# Altium project Controller R2.PrjPcb
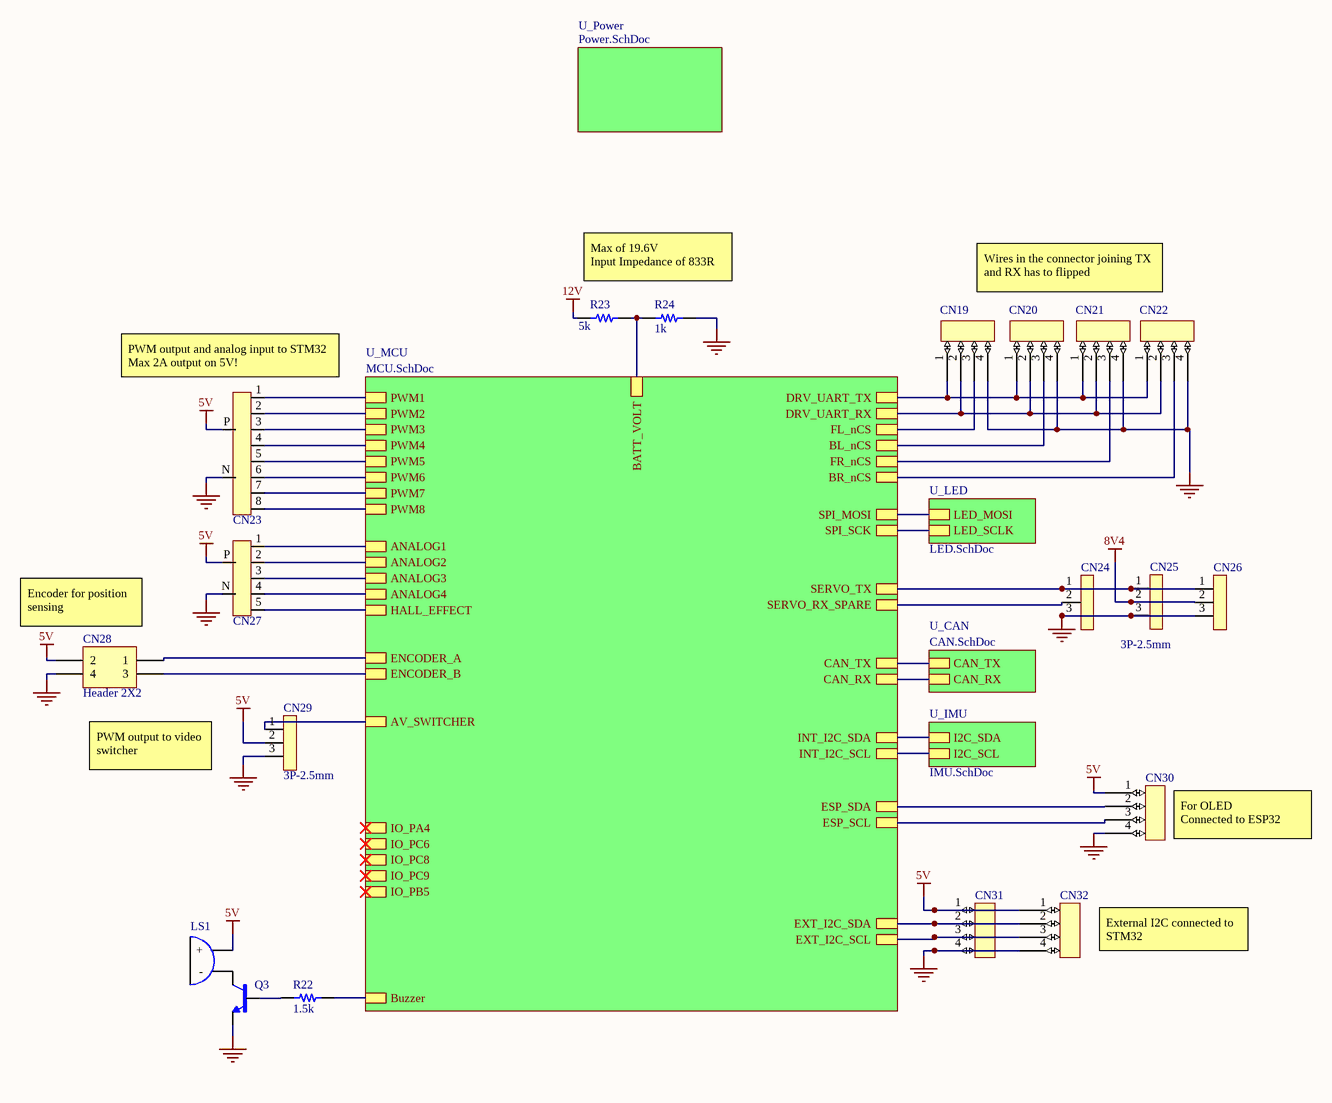
[diagram p0: Controller R2.SchDoc]
6 sheets, 132 parts. Net scope: hierarchical (ports join the sheet entries above them; power ports are global).
Board file: Controller R2.PcbDoc
Sheets:
  Controller R2.SchDoc
    U_Power = Power.SchDoc
    U_CAN = CAN.SchDoc
    U_IMU = IMU.SchDoc
    U_LED = LED.SchDoc
    U_MCU = MCU.SchDoc

## Sheet Controller R2.SchDoc
size A3

### Parts
CN19  JST_GH-4P  [JST_GH-4P]  (value not drawn)
CN20  JST_GH-4P  [JST_GH-4P]  (value not drawn)
CN21  JST_GH-4P  [JST_GH-4P]  (value not drawn)
CN22  JST_GH-4P  [JST_GH-4P]  (value not drawn)
CN23  8P-Signal-2.5mm  [8ch-signal-header]  (value not drawn)
CN24  3P-2.5mm  [2.5mm-3P]  (value not drawn)
CN25  3P-2.5mm  [2.5mm-3P]  (value not drawn)
CN26  3P-2.5mm  [2.5mm-3P]
CN27  5P-Signal-2.5mm  [5ch-signal-header]  (value not drawn)
CN28  Header 2X2  [HDR2X2]
CN29  3P-2.5mm  [2.5mm-3P]
CN30  JST_GH-4P  [JST_GH-4P]  (value not drawn)
CN31  JST_GH-4P  [JST_GH-4P]  (value not drawn)
CN32  JST_GH-4P  [JST_GH-4P]  (value not drawn)
LS1  Buzzer  [12-dia-buzzer]  (value not drawn)
Q3  S8050  [SOT23-FET]  (value not drawn)
R22  1.5k  [0805 - duplicate]
R23  5k  [0805 - duplicate]
R24  1k  [0805 - duplicate]

### Sub-sheets
U_CAN = CAN.SchDoc: CAN_TX, CAN_RX
U_IMU = IMU.SchDoc: I2C_SCL, I2C_SDA
U_LED = LED.SchDoc: LED_MOSI, LED_SCLK
U_MCU = MCU.SchDoc: FL_nCS, BL_nCS, FR_nCS, BR_nCS, PWM5, PWM6, PWM7, PWM8, PWM4, PWM1, ENCODER_A, ENCODER_B, SERVO_TX, SERVO_RX_SPARE, ANALOG1, HALL_EFFECT, ANALOG4, ANALOG3, BATT_VOLT, PWM2, PWM3, SPI_MOSI, SPI_SCK, EXT_I2C_SCL, EXT_I2C_SDA, CAN_TX, CAN_RX, INT_I2C_SDA, INT_I2C_SCL, DRV_UART_RX, DRV_UART_TX, AV_SWITCHER, Buzzer, ESP_SDA, ESP_SCL, IO_PA4, IO_PC6, IO_PC8, IO_PC9, IO_PB5, ANALOG2
U_Power = Power.SchDoc: no entries

### Nets
5V: CN23.P CN27.P CN28.2 CN29.2 CN30.1 CN31.1 CN32.1 LS1.A(+)
8V4: CN25.2 CN26.2
12V: R23.1
GND: CN19.4 CN20.4 CN21.4 CN22.4 CN23.N CN24.3 CN25.3 CN26.3 CN27.N CN28.4 CN29.3 CN30.4 CN31.4 CN32.4 Q3.2(E) R24.2
SWO: CN19.1 CN20.1 CN21.1 CN22.1 ; sheet U_MCU/DRV_UART_TX
NetCN19_2: CN19.2 CN20.2 CN21.2 CN22.2 ; sheet U_MCU/DRV_UART_RX
NetCN19_3: CN19.3 ; sheet U_MCU/FL_nCS
NetCN20_3: CN20.3 ; sheet U_MCU/BL_nCS
NetCN21_3: CN21.3 ; sheet U_MCU/FR_nCS
NetCN22_3: CN22.3 ; sheet U_MCU/BR_nCS
NetCN23_1: CN23.1 ; sheet U_MCU/PWM1
NetCN23_2: CN23.2 ; sheet U_MCU/PWM2
NetCN23_3: CN23.3 ; sheet U_MCU/PWM3
NetCN23_4: CN23.4 ; sheet U_MCU/PWM4
NetCN23_5: CN23.5 ; sheet U_MCU/PWM5
NetCN23_6: CN23.6 ; sheet U_MCU/PWM6
NetCN23_7: CN23.7 ; sheet U_MCU/PWM7
NetCN23_8: CN23.8 ; sheet U_MCU/PWM8
NetCN24_1: CN24.1 CN25.1 CN26.1 ; sheet U_MCU/SERVO_TX
NetCN24_2: CN24.2 ; sheet U_MCU/SERVO_RX_SPARE
NetCN27_1: CN27.1 ; sheet U_MCU/ANALOG1
NetCN27_2: CN27.2 ; sheet U_MCU/ANALOG2
NetCN27_3: CN27.3 ; sheet U_MCU/ANALOG3
NetCN27_4: CN27.4 ; sheet U_MCU/ANALOG4
NetCN27_5: CN27.5 ; sheet U_MCU/HALL_EFFECT
NetCN28_1: CN28.1 ; sheet U_MCU/ENCODER_A
NetCN28_3: CN28.3 ; sheet U_MCU/ENCODER_B
NetCN29_1: CN29.1 ; sheet U_MCU/AV_SWITCHER
NetCN30_2: CN30.2 ; sheet U_MCU/ESP_SDA
NetCN30_3: CN30.3 ; sheet U_MCU/ESP_SCL
NetCN31_2: CN31.2 CN32.2 ; sheet U_MCU/EXT_I2C_SDA
NetCN31_3: CN31.3 CN32.3 ; sheet U_MCU/EXT_I2C_SCL
NetLS1_K: LS1.K(-) Q3.3(C)
NetQ3_1: Q3.1(B) R22.1
NetR22_2: R22.2 ; sheet U_MCU/Buzzer
NetR23_2: R23.2 R24.1 ; sheet U_MCU/BATT_VOLT
NetU1_1: sheet U_CAN/CAN_TX, sheet U_MCU/CAN_TX
NetU1_4: sheet U_CAN/CAN_RX, sheet U_MCU/CAN_RX
NetU2_23: sheet U_IMU/I2C_SCL, sheet U_MCU/INT_I2C_SCL
NetU2_24: sheet U_IMU/I2C_SDA, sheet U_MCU/INT_I2C_SDA
NetU3_1: sheet U_LED/LED_MOSI, sheet U_MCU/SPI_MOSI
NetU4_1: sheet U_LED/LED_SCLK, sheet U_MCU/SPI_SCK

### Notes on the sheet
- Max of 19.6V
  Input Impedance of 833R
- Wires in the connector joining TX and RX has to flipped
- (near CN23) PWM output and analog input to STM32
  Max 2A output on 5V!
- (near CN28) Encoder for position sensing
- PWM output to video switcher
- (near CN30) For OLED
  Connected to ESP32
- (near CN32) External I2C connected to STM32

### Library data of the parts
CN28 = Header 2X2: Header, 2-Pin, Dual row; LatestRevisionDate: 17-Jul-2002; LatestRevisionNote: Re-released for DXP Platform.; Publisher: Altium Limited
Q3 = S8050: MF: MICROSS/On Semiconductor; MP: 2N2222; Value: *; Package: TO-18-3 NJS; Digi-Key_Purchase_URL: https://www.digikey.com.mx/product-detail/en/microsemi-corporation/JANS2N2222A/1086-15156-ND/4384334?utm_source=snapeda&utm_medium=aggregator&utm_campaign=symbol; SnapEDA_Link: https://www.snapeda.com/parts/2N2222/MICROSS/On%20Semiconductor/view-part/561967/?ref=snap; Digi-Key_Part_Number: 1086-15156-ND
R22-R24 = Resistor

## Sheet Power.SchDoc
size A3
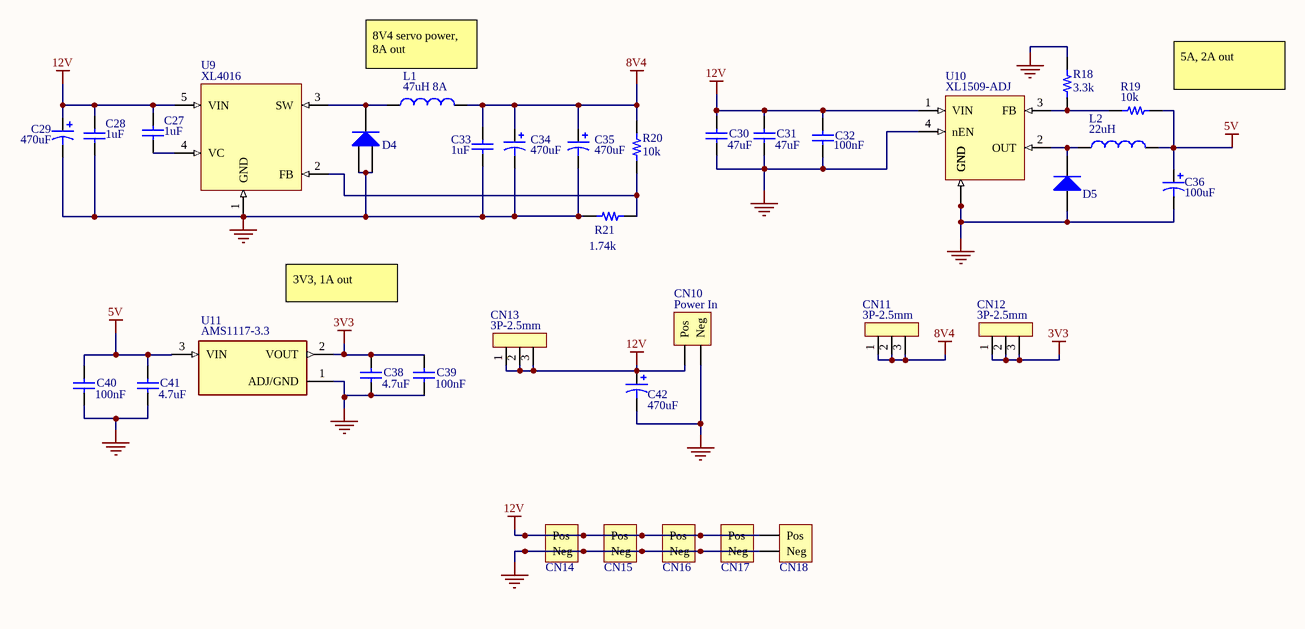
[diagram p1: Power.SchDoc]

### Parts
C27  value 1uF  [0402]  (hidden comment: Cap)
C28  value 1uF  [0402]  (hidden comment: Cap)
C29  470uF  [10x12mm-Electrolytic]
C30  value 47uF  [1206]  (hidden comment: Cap)
C31  value 47uF  [1206]  (hidden comment: Cap)
C32  value 100nF  [0402]  (hidden comment: Cap)
C33  value 1uF  [0402]  (hidden comment: Cap)
C34  470uF  [10x12mm-Electrolytic]
C35  470uF  [10x12mm-Electrolytic]
C36  100uF  [10x12mm-Electrolytic]
C38  value 4.7uF  [0805 - duplicate]  (hidden comment: Cap)
C39  value 100nF  [0402]  (hidden comment: Cap)
C40  value 100nF  [0402]  (hidden comment: Cap)
C41  value 4.7uF  [0805 - duplicate]  (hidden comment: Cap)
C42  470uF  [10x12mm-Electrolytic]
CN10  Power In  [Power_Leads]
CN11  3P-2.5mm  [2.5mm-3P]
CN12  3P-2.5mm  [2.5mm-3P]
CN13  3P-2.5mm  [2.5mm-3P]
CN14  JST_Leads_In  [Power_Leads]  (value not drawn)
CN15  JST_Leads_In  [Power_Leads]  (value not drawn)
CN16  JST_Leads_In  [Power_Leads]  (value not drawn)
CN17  JST_Leads_In  [Power_Leads]  (value not drawn)
CN18  JST_Leads_In  [Power_Leads]  (value not drawn)
D4  Diode  [PowerDi5]  (value not drawn)
D5  SS24  [DO-214AA]  (value not drawn)
L1  47uH 8A  [18x16-9-Inductor]
L2  22uH  [71x66-Inductor]
R18  3.3k  [0805 - duplicate]
R19  10k  [0805 - duplicate]
R20  10k  [0805 - duplicate]
R21  1.74k  [0805 - duplicate]
U9  XL4016  [TO220-5L]
U10  XL1509-ADJ  [SOP8-MT3420]
U11  AMS1117-3.3  [SOT229P700X180-4N]

### Nets
3V3: C38.2 C39.2 CN12.1 CN12.2 CN12.3 U11.2(VOUT)
5V: C36.1 C40.2 C41.2 L2.2 R19.2 U11.3(VIN)
8V4: C33.2 C34.1 C35.1 CN11.1 CN11.2 CN11.3 L1.2 R20.2
12V: C27.2 C28.2 C29.1 C30.2 C31.2 C32.2 C42.1 CN10.A(Pos) CN13.1 CN13.2 CN13.3 CN14.A(Pos) CN15.A(Pos) CN16.A(Pos) CN17.A(Pos) CN18.A(Pos) U9.5(VIN) U10.1(VIN)
GND: C28.1 C29.2 C30.1 C31.1 C32.1 C33.1 C34.2 C35.2 C36.2 C38.1 C39.1 C40.1 C41.1 C42.2 CN10.K(Neg) CN14.K(Neg) CN15.K(Neg) CN16.K(Neg) CN17.K(Neg) CN18.K(Neg) D4.1(A) D4.2(A) D5.A R18.2 R21.1 U9.1(GND) U10.4(nEN) U10.5(GND) U10.6(GND) U10.7(GND) U10.8(GND) U11.1(ADJ/GND)
NetC27_1: C27.1 U9.4(VC)
NetD4_3: D4.3(K) L1.1 U9.3(SW)
NetD5_K: D5.K L2.1 U10.2(OUT)
NetR18_1: R18.1 R19.1 U10.3(FB)
NetR20_1: R20.1 R21.2 U9.2(FB)

### Notes on the sheet
- (near L1) 8V4 servo power, 8A out
- (near R19) 5A, 2A out
- 3V3, 1A out

### Library data of the parts
C29 C34-C36 C42 = Polarised Capacitor
CN10 = JST_Leads_In
D5 = SS24: 2A Schottky Diode
L1 = SMD Inductor 18x16.9: TMPC1707
L2 = 22uH Inductor, 7.1*6.6
R18-R21 = Resistor
U9 = XL4016: 8A Buck COnverter
U10 = XL1509-5
U11 = AMS1117-3.3: Sot223/Pkg 1-Amp 3.3-Volt Low Drop Out Voltage Regulatator; MF: Advanced Monolithic Systems; Price: None; Package: None; Value: *; MP: AMS1117-3.3; Availability: Unavailable; SnapEDA_Link: https://www.snapeda.com/parts/AMS1117-3.3/Advanced%20Monolithic%20Systems/view-part/53450/?ref=snap
C27 C28 C30-C33 C38-C41 = Cap: Published: 8-Jun-2000; LatestRevisionDate: 17-Jul-2002; LatestRevisionNote: Re-released for DXP Platform.; PackageReference: RAD-0.3; Publisher: Altium Limited; PackageDescription: Radial Cap, Thru-Hole; 2 Leads; 0.3 in Pin Spacing
D4 = Diode: Published: 8-Jun-2000; LatestRevisionDate: 17-Jul-2002; LatestRevisionNote: Re-released for DXP Platform.; PackageVersion: Sep-1996; PackageReference: SMC; Publisher: Altium Limited; PackageDescription: DO-214-AB/SMC; 2 C-Bend Leads; Body 7.9 x 5.9 mm, inc. leads (LxW); Code_JEDEC: DO-214-AB

## Sheet CAN.SchDoc
size A3
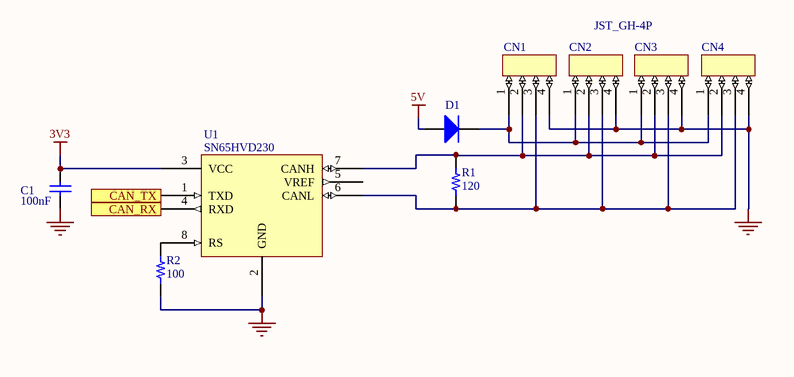
[diagram p2: CAN.SchDoc]

### Parts
C1  value 100nF  [0402]  (hidden comment: Cap)
CN1  JST_GH-4P  [JST_GH-4P]
CN2  JST_GH-4P  [JST_GH-4P]  (value not drawn)
CN3  JST_GH-4P  [JST_GH-4P]  (value not drawn)
CN4  JST_GH-4P  [JST_GH-4P]  (value not drawn)
D1  SS12F  [SMAF_DIODE]  (value not drawn)
R1  120  [2010_SMD_Resistor]
R2  100  [0805 - duplicate]
U1  SN65HVD230  [SOIC8-TI_CAN]

### Ports
CAN_RX, CAN_TX

### Nets
3V3: C1.2 U1.3(VCC)
5V: D1.1(A)
GND: C1.1 CN1.4 CN2.4 CN3.4 CN4.4 R2.1 U1.2(GND)
NetCN1_1: CN1.1 CN2.1 CN3.1 CN4.1 D1.2(K)
NetCN1_2: CN1.2 CN2.2 CN3.2 CN4.2 R1.2 U1.7(CANH)
NetCN1_3: CN1.3 CN2.3 CN3.3 CN4.3 R1.1 U1.6(CANL)
NetR2_2: R2.2 U1.8(RS)
NetU1_1: U1.1(TXD) ; port CAN_TX
NetU1_4: U1.4(RXD) ; port CAN_RX

Not connected (* = marked no-connect by the designer): U1 5(VREF)

### Library data of the parts
R1 R2 = Resistor
U1 = SN65HVD230: CAN Transceiver
C1 = Cap: Published: 8-Jun-2000; LatestRevisionDate: 17-Jul-2002; LatestRevisionNote: Re-released for DXP Platform.; PackageReference: RAD-0.3; Publisher: Altium Limited; PackageDescription: Radial Cap, Thru-Hole; 2 Leads; 0.3 in Pin Spacing

## Sheet IMU.SchDoc
size A3
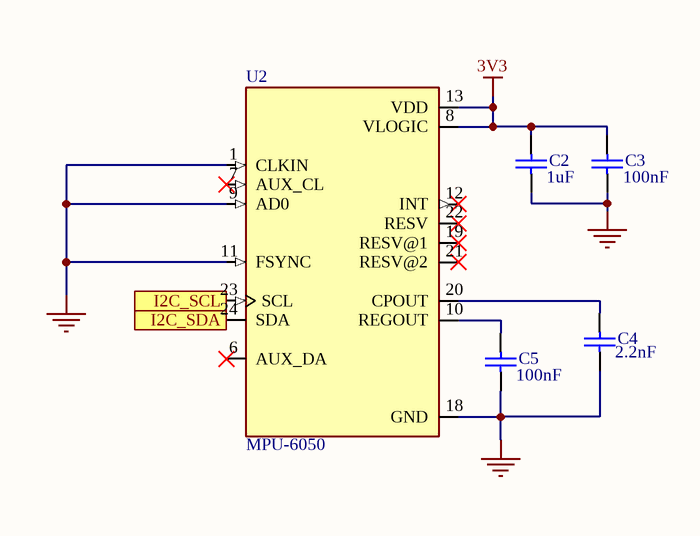
[diagram p3: IMU.SchDoc]

### Parts
C2  value 1uF  [0402]  (hidden comment: Cap)
C3  value 100nF  [0402]  (hidden comment: Cap)
C4  value 2.2nF  [0402]  (hidden comment: Cap)
C5  value 100nF  [0402]  (hidden comment: Cap)
U2  MPU-6050  [QFN50P400X400X95-24N]

### Ports
I2C_SCL, I2C_SDA

### Nets
3V3: C2.2 C3.2 U2.8(VLOGIC) U2.13(VDD)
GND: C2.1 C3.1 C4.1 C5.1 U2.1(CLKIN) U2.9(AD0) U2.11(FSYNC) U2.18(GND)
NetC4_2: C4.2 U2.20(CPOUT)
NetC5_2: C5.2 U2.10(REGOUT)
NetU2_23: U2.23(SCL) ; port I2C_SCL
NetU2_24: U2.24(SDA) ; port I2C_SDA

Not connected (* = marked no-connect by the designer): U2 6(AUX_DA)* 7(AUX_CL)* 12(INT)* 19(RESV@1)* 21(RESV@2)* 22(RESV)*

### Library data of the parts
U2 = MPU-6050: Accelerometer, Gyroscope, 6 Axis Sensor IÂ²C Output; MF: TDK InvenSense; Price: None; Package: VFQFN-24 TDK InvenSense; MP: MPU-6050; Value: *; Availability: Unavailable; SnapEDA_Link: https://www.snapeda.com/parts/MPU-6050/TDK%20InvenSense/view-part/4503180/?ref=snap
C2-C5 = Cap: Published: 8-Jun-2000; LatestRevisionDate: 17-Jul-2002; LatestRevisionNote: Re-released for DXP Platform.; PackageReference: RAD-0.3; Publisher: Altium Limited; PackageDescription: Radial Cap, Thru-Hole; 2 Leads; 0.3 in Pin Spacing

## Sheet LED.SchDoc
size A3
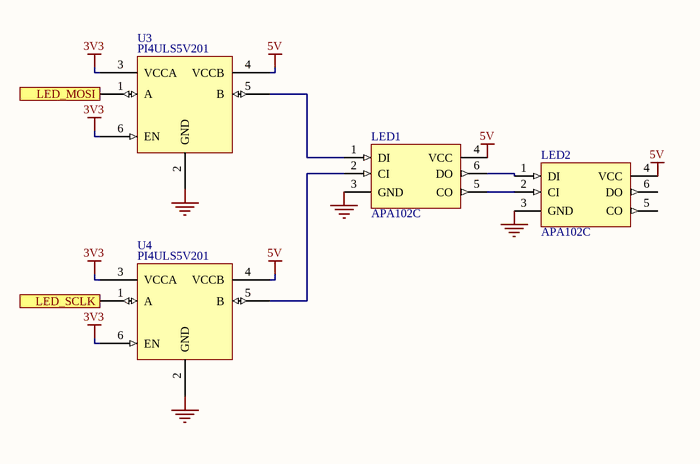
[diagram p4: LED.SchDoc]

### Parts
LED1  APA102C  [5x5_WS2812]
LED2  APA102C  [5x5_WS2812]
U3  PI4ULS5V201  [SOT23-PI4ULS5V201]
U4  PI4ULS5V201  [SOT23-PI4ULS5V201]

### Ports
LED_MOSI, LED_SCLK

### Nets
3V3: U3.3(VCCA) U3.6(EN) U4.3(VCCA) U4.6(EN)
5V: LED1.4(VCC) LED2.4(VCC) U3.4(VCCB) U4.4(VCCB)
GND: LED1.3(GND) LED2.3(GND) U3.2(GND) U4.2(GND)
NetLED1_1: LED1.1(DI) U3.5(B)
NetLED1_2: LED1.2(CI) U4.5(B)
NetLED1_5: LED1.5(CO) LED2.2(CI)
NetLED1_6: LED1.6(DO) LED2.1(DI)
NetU3_1: U3.1(A) ; port LED_MOSI
NetU4_1: U4.1(A) ; port LED_SCLK

Not connected (* = marked no-connect by the designer): LED2 5(CO) 6(DO)

### Library data of the parts
U3 U4 = PI4ULS5V201: Level Translator

## Sheet MCU.SchDoc
size A3
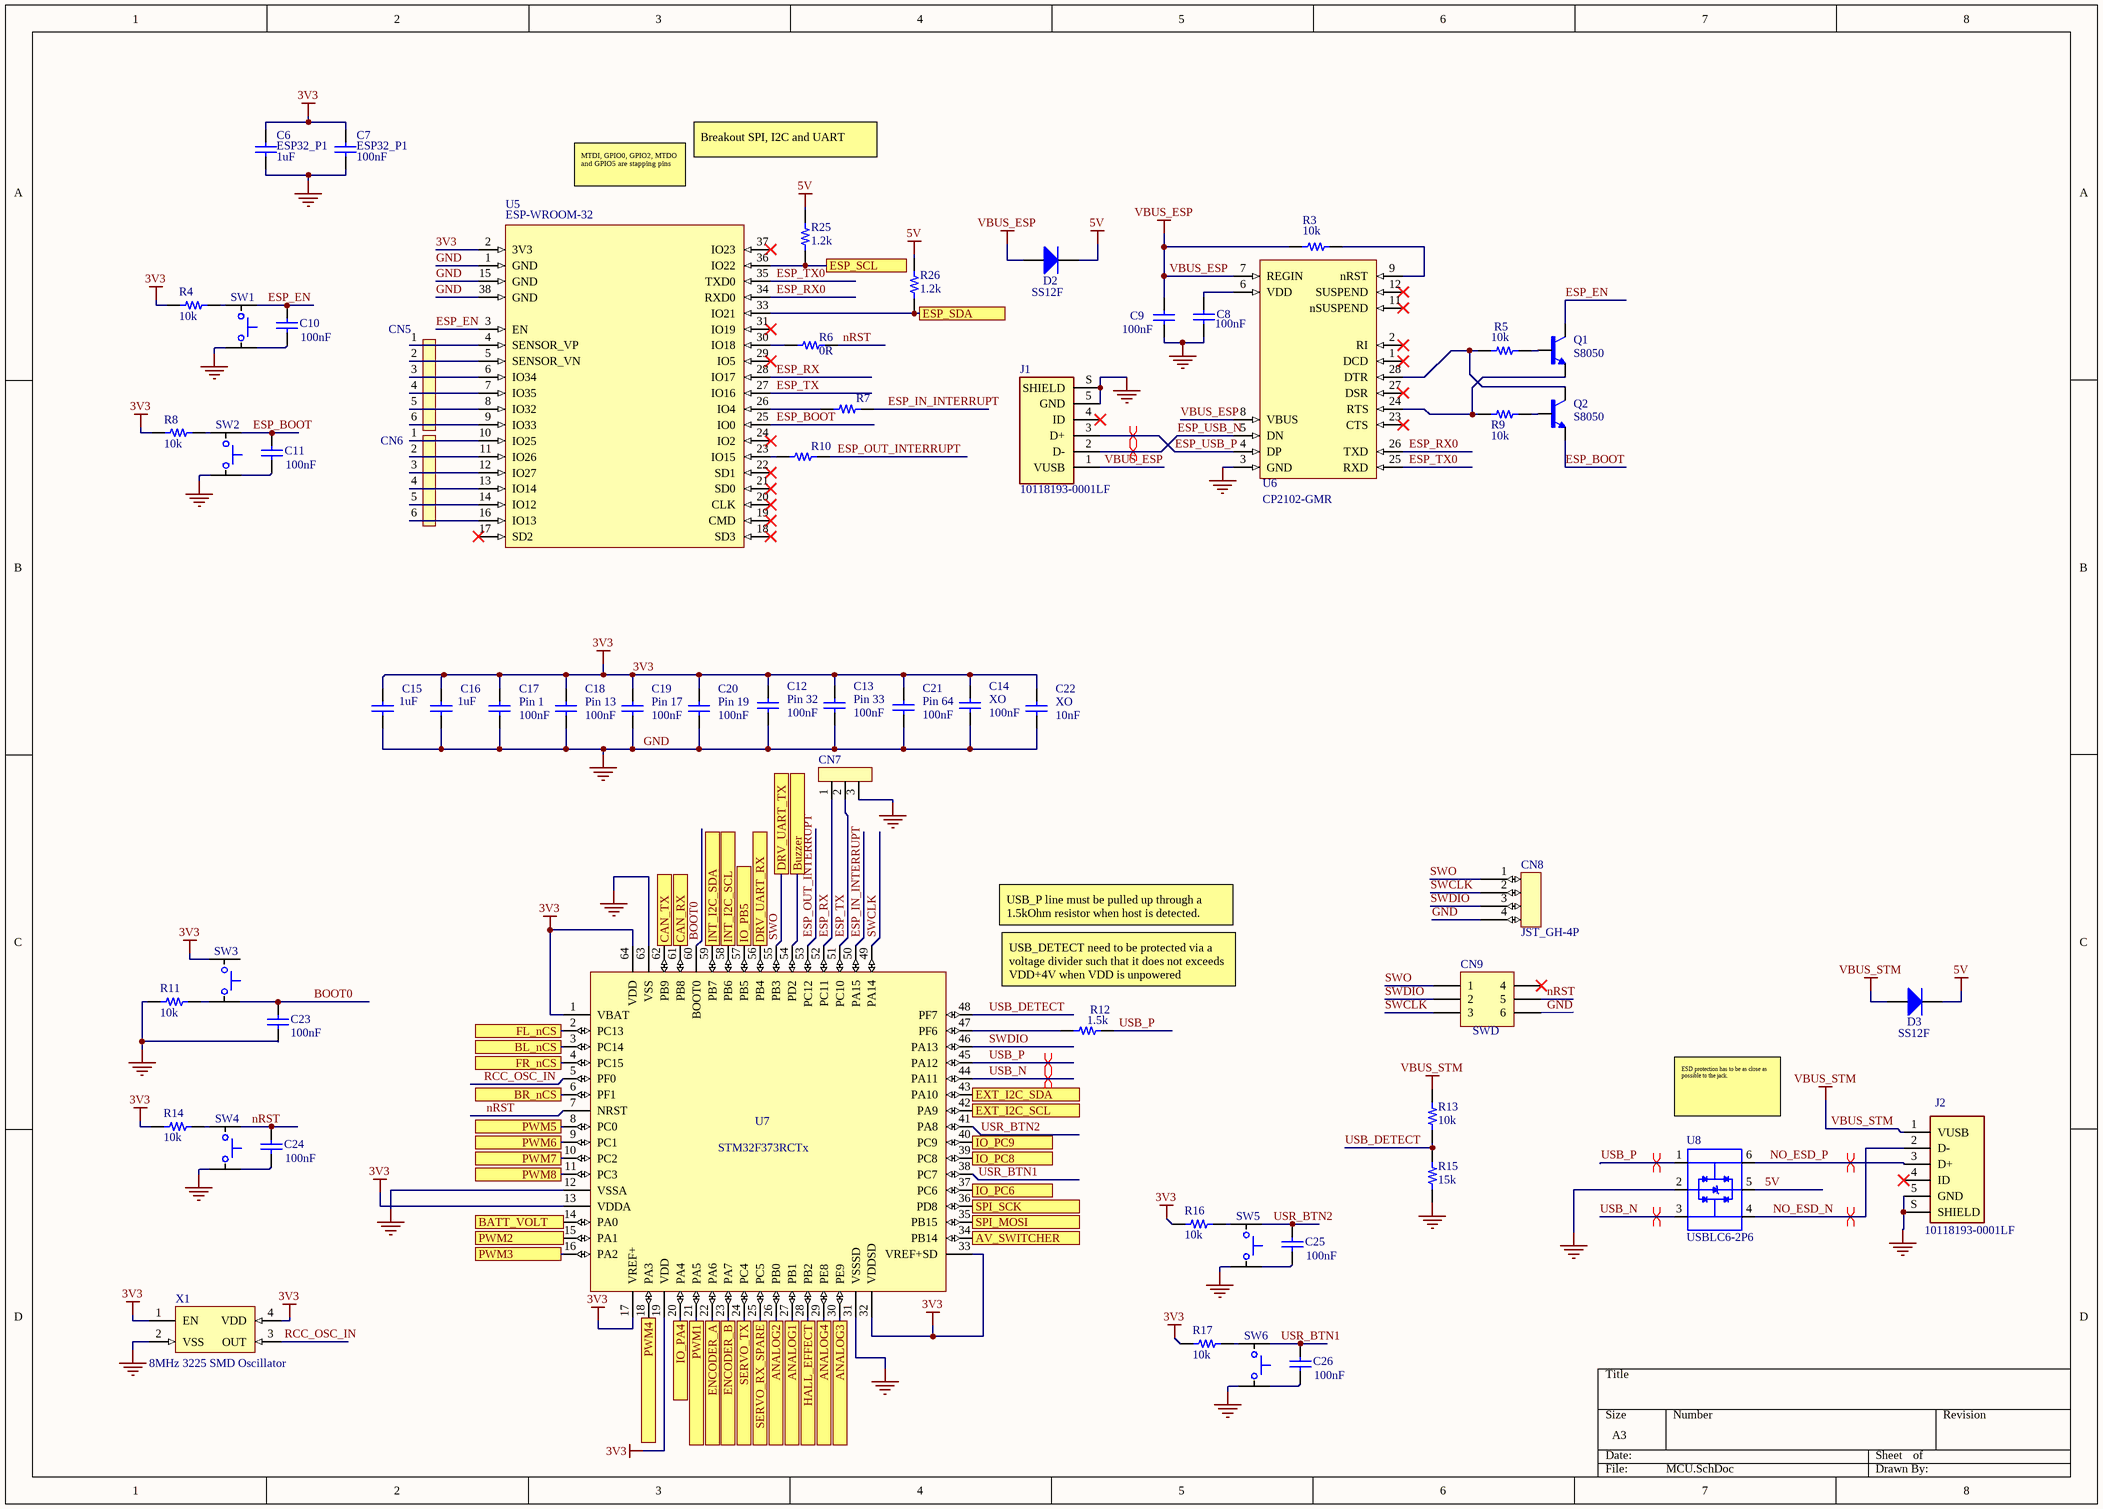
[diagram p5: MCU.SchDoc]

### Parts
C6  ESP32_P1  value 1uF  [0402]
C7  ESP32_P1  value 100nF  [0402]
C8  value 100nF  [0402]  (hidden comment: P6)
C9  value 100nF  [0402]  (hidden comment: P7)
C10  value 100nF  [0402]  (hidden comment: Cap)
C11  value 100nF  [0402]  (hidden comment: Cap)
C12  Pin 32  value 100nF  [0402]
C13  Pin 33  value 100nF  [0402]
C14  XO  value 100nF  [0402]
C15  value 1uF  [0402]
C16  value 1uF  [0402]
C17  Pin 1  value 100nF  [0402]
C18  Pin 13  value 100nF  [0402]
C19  Pin 17  value 100nF  [0402]
C20  Pin 19  value 100nF  [0402]
C21  Pin 64  value 100nF  [0402]
C22  XO  value 10nF  [0402]
C23  value 100nF  [0402]  (hidden comment: Cap)
C24  value 100nF  [0402]  (hidden comment: Cap)
C25  value 100nF  [0402]  (hidden comment: Cap)
C26  value 100nF  [0402]  (hidden comment: Cap)
CN5  6P-2.5mm  [6-Pin-Header]  (value not drawn)
CN6  6P-2.5mm  [6-Pin-Header]  (value not drawn)
CN7  3P-2.5mm  [2.5mm-3P]  (value not drawn)
CN8  JST_GH-4P  [JST_GH-4P]
CN9  SWD  [HDR2X3_CEN]
D2  SS12F  [SMAF_DIODE]
D3  SS12F  [SMAF_DIODE]
J1  10118193-0001LF  [FCI_10118193-0001LF]
J2  10118193-0001LF  [FCI_10118193-0001LF]
Q1  S8050  [SOT23-FET]
Q2  S8050  [SOT23-FET]
R3  10k  [0805 - duplicate]
R4  10k  [0805 - duplicate]
R5  10k  [0805 - duplicate]
R6  0R  [0805 - duplicate]
R7  1k  [0805 - duplicate]  (value not drawn)
R8  10k  [0805 - duplicate]
R9  10k  [0805 - duplicate]
R10  1k  [0805 - duplicate]  (value not drawn)
R11  10k  [0805 - duplicate]
R12  1.5k  [0805 - duplicate]
R13  10k  [2010_SMD_Resistor]
R14  10k  [0805 - duplicate]
R15  15k  [2010_SMD_Resistor]
R16  10k  [0805 - duplicate]
R17  10k  [0805 - duplicate]
R25  1.2k  [0805 - duplicate]
R26  1.2k  [0805 - duplicate]
SW1  SPST Switch  [4.8x4.8-SMD-SWITCH]  (value not drawn)
SW2  SPST Switch  [4.8x4.8-SMD-SWITCH]  (value not drawn)
SW3  SPST Switch  [4.8x4.8-SMD-SWITCH]  (value not drawn)
SW4  SPST Switch  [4.8x4.8-SMD-SWITCH]  (value not drawn)
SW5  USR_BTN2  [4.8x4.8-SMD-SWITCH]  (value not drawn)
SW6  USR_BTN1  [4.8x4.8-SMD-SWITCH]  (value not drawn)
U5  ESP-WROOM-32  [ESP-WROOM-32]
U6  CP2102-GMR  [QFN28G_0.5-5X5MM]
U7  STM32F373RCTx  [LQFP64]
U8  USBLC6-2P6  [SOT50P160X60-6N]
X1  8MHz 3225 SMD Oscillator  [3.2x2.5 SMD]

### Ports
ANALOG1, ANALOG2, ANALOG3, ANALOG4, AV_SWITCHER, BATT_VOLT, BL_nCS, BR_nCS, Buzzer, CAN_RX, CAN_TX, DRV_UART_RX, DRV_UART_TX, ENCODER_A, ENCODER_B, ESP_SCL, ESP_SDA, EXT_I2C_SCL, EXT_I2C_SDA, FL_nCS, FR_nCS, HALL_EFFECT, INT_I2C_SCL, INT_I2C_SDA, IO_PA4, IO_PB5, IO_PC6, IO_PC8, IO_PC9, PWM1, PWM2, PWM3, PWM4, PWM5, PWM6, PWM7, PWM8, SERVO_RX_SPARE, SERVO_TX, SPI_MOSI, SPI_SCK

### Nets
3V3: C6.2 C7.2 C12.2 C13.2 C14.2 C15.2 C16.2 C17.2 C18.2 C19.2 C20.2 C21.2 C22.2 R4.1 R8.1 R14.1 R16.1 R17.1 SW3.1 U5.2(3V3) U7.1(VBAT) U7.13(VDDA) U7.17(VREF+) U7.19(VDD) U7.32(VDDSD) U7.33(VREF+SD) U7.64(VDD) X1.1(EN) X1.4(VDD)
5V: D2.2(K) D3.2(K) R25.2 R26.2 U8.5(VBUS)
GND: C6.1 C7.1 C8.1 C9.1 C12.1 C13.1 C14.1 C15.1 C16.1 C17.1 C18.1 C19.1 C20.1 C21.1 C22.1 C23.2 CN7.3 CN8.4 CN9.6 J1.5(GND) J1.S(SHIELD) J2.5(GND) J2.S(SHIELD) R11.1 R15.1 SW1.3 SW2.3 SW4.3 SW5.3 SW6.3 U5.1(GND) U5.15(GND) U5.38(GND) U6.3(GND) U7.12(VSSA) U7.31(VSSSD) U7.63(VSS) U8.2(GND) X1.2(VSS)
VBUS_ESP: C9.2 D2.1(A) J1.1(VUSB) R3.1 U6.7(REGIN) U6.8(VBUS)
VBUS_STM: D3.1(A) J2.1(VUSB) R13.2
BOOT0: C23.1 SW3.4 U7.60(BOOT0)
ESP_BOOT: C11.2 Q2.2(E) SW2.2 U5.25(IO0)
ESP_EN: C10.2 Q1.3(C) SW1.2 U5.3(EN)
ESP_IN_INTERRUPT: R7.2 U7.50(PA15)
ESP_OUT_INTERRUPT: R10.2 U7.53(PC12)
ESP_RX: CN7.1 U5.28(IO17) U7.52(PC11)
ESP_RX0: U5.34(RXD0) U6.26(TXD)
ESP_TX: CN7.2 U5.27(IO16) U7.51(PC10)
ESP_TX0: U5.35(TXD0) U6.25(RXD)
ESP_USB_N: J1.2(D-) U6.5(DN)
ESP_USB_P: J1.3(D+) U6.4(DP)
NO_ESD_N: J2.2(D-) U8.4(I/O2_2)
NO_ESD_P: J2.3(D+) U8.6(I/O1_2)
nRST: C24.2 CN9.5 R6.2 SW4.2 U7.7(NRST)
RCC_OSC_IN: U7.5(PF0) X1.3(OUT)
SWCLK: CN8.2 CN9.3 U7.49(PA14)
SWDIO: CN8.3 CN9.2 U7.46(PA13)
SWO: CN8.1 CN9.1 U7.55(PB3) ; port DRV_UART_TX
USB_DETECT: R13.1 R15.2 U7.48(PF7)
USB_N: U7.44(PA11) U8.3(I/O2_1)
USB_P: R12.2 U7.45(PA12) U8.1(I/O1_1)
USR_BTN1: C26.2 SW6.2 U7.38(PC7)
USR_BTN2: C25.2 SW5.2 U7.41(PA8)
NetC8_2: C8.2 U6.6(VDD)
NetC10_1: C10.1 SW1.4
NetC11_1: C11.1 SW2.4
NetC24_1: C24.1 SW4.4
NetC25_1: C25.1 SW5.4
NetC26_1: C26.1 SW6.4
NetCN5_1: CN5.1 U5.4(SENSOR_VP)
NetCN5_2: CN5.2 U5.5(SENSOR_VN)
NetCN5_3: CN5.3 U5.6(IO34)
NetCN5_4: CN5.4 U5.7(IO35)
NetCN5_5: CN5.5 U5.8(IO32)
NetCN5_6: CN5.6 U5.9(IO33)
NetCN6_1: CN6.1 U5.10(IO25)
NetCN6_2: CN6.2 U5.11(IO26)
NetCN6_3: CN6.3 U5.12(IO27)
NetCN6_4: CN6.4 U5.13(IO14)
NetCN6_5: CN6.5 U5.14(IO12)
NetCN6_6: CN6.6 U5.16(IO13)
NetCN19_2: U7.56(PB4) ; port DRV_UART_RX
NetCN19_3: U7.2(PC13) ; port FL_nCS
NetCN20_3: U7.3(PC14) ; port BL_nCS
NetCN21_3: U7.4(PC15) ; port FR_nCS
NetCN22_3: U7.6(PF1) ; port BR_nCS
NetCN23_1: U7.21(PA5) ; port PWM1
NetCN23_2: U7.15(PA1) ; port PWM2
NetCN23_3: U7.16(PA2) ; port PWM3
NetCN23_4: U7.18(PA3) ; port PWM4
NetCN23_5: U7.8(PC0) ; port PWM5
NetCN23_6: U7.9(PC1) ; port PWM6
NetCN23_7: U7.10(PC2) ; port PWM7
NetCN23_8: U7.11(PC3) ; port PWM8
NetCN24_1: U7.24(PC4) ; port SERVO_TX
NetCN24_2: U7.25(PC5) ; port SERVO_RX_SPARE
NetCN27_1: U7.27(PB1) ; port ANALOG1
NetCN27_2: U7.26(PB0) ; port ANALOG2
NetCN27_3: U7.30(PE9) ; port ANALOG3
NetCN27_4: U7.29(PE8) ; port ANALOG4
NetCN27_5: U7.28(PB2) ; port HALL_EFFECT
NetCN28_1: U7.22(PA6) ; port ENCODER_A
NetCN28_3: U7.23(PA7) ; port ENCODER_B
NetCN29_1: U7.34(PB14) ; port AV_SWITCHER
NetCN30_2: R26.1 U5.33(IO21) ; port ESP_SDA
NetCN30_3: R25.1 U5.36(IO22) ; port ESP_SCL
NetCN31_2: U7.43(PA10) ; port EXT_I2C_SDA
NetCN31_3: U7.42(PA9) ; port EXT_I2C_SCL
NetQ1_1: Q1.1(B) R5.2
NetQ1_2: Q1.2(E) R9.1 U6.24(RTS)
NetQ2_1: Q2.1(B) R9.2
NetQ2_3: Q2.3(C) R5.1 U6.28(DTR)
NetR3_2: R3.2 U6.9(nRST)
NetR4_2: R4.2 SW1.1
NetR6_1: R6.1 U5.30(IO18)
NetR7_1: R7.1 U5.26(IO4)
NetR8_2: R8.2 SW2.1
NetR10_1: R10.1 U5.23(IO15)
NetR11_2: R11.2 SW3.3
NetR12_1: R12.1 U7.47(PF6)
NetR14_2: R14.2 SW4.1
NetR16_2: R16.2 SW5.1
NetR17_2: R17.2 SW6.1
NetR22_2: U7.54(PD2) ; port Buzzer
NetR23_2: U7.14(PA0) ; port BATT_VOLT
NetU1_1: U7.62(PB9) ; port CAN_TX
NetU1_4: U7.61(PB8) ; port CAN_RX
NetU2_23: U7.58(PB6) ; port INT_I2C_SCL
NetU2_24: U7.59(PB7) ; port INT_I2C_SDA
NetU3_1: U7.35(PB15) ; port SPI_MOSI
NetU4_1: U7.36(PD8) ; port SPI_SCK
NetU7_20: U7.20(PA4) ; port IO_PA4
NetU7_37: U7.37(PC6) ; port IO_PC6
NetU7_39: U7.39(PC8) ; port IO_PC8
NetU7_40: U7.40(PC9) ; port IO_PC9
NetU7_57: U7.57(PB5) ; port IO_PB5

Not connected (* = marked no-connect by the designer): CN9 4*; J1 4(ID)*; J2 4(ID)*; SW3 2; U5 17(SD2)* 18(SD3)* 19(CMD)* 20(CLK)* 21(SD0)* 22(SD1)* 24(IO2)* 29(IO5)* 31(IO19)* 37(IO23)*; U6 1(DCD)* 2(RI)* 11(nSUSPEND)* 12(SUSPEND)* 23(CTS)* 27(DSR)*

### Layout directives
differential pair: ESP_USB_N, ESP_USB_P, NO_ESD_N, NO_ESD_P, USB_N, USB_P

### Notes on the sheet
- MTDI, GPIO0, GPIO2, MTDO and GPIO5 are stapping pins
- Breakout SPI, I2C and UART
- USB_P line must be pulled up through a 1.5kOhm resistor when host is detected.
- USB_DETECT need to be protected via a voltage divider such that it does not exceeds VDD+4V when VDD is unpowered
- (near U8) ESD protection has to be as close as possible to the jack.

### Library data of the parts
C6-C9 C12-C22 = Cap: Published: 8-Jun-2000; LatestRevisionDate: 17-Jul-2002; LatestRevisionNote: Re-released for DXP Platform.; PackageReference: RAD-0.3; Publisher: Altium Limited; PackageDescription: Radial Cap, Thru-Hole; 2 Leads; 0.3 in Pin Spacing
CN9 = Header 3X2A: Header, 3-Pin, Dual row; LatestRevisionDate: 17-Jul-2002; LatestRevisionNote: Re-released for DXP Platform.; Publisher: Altium Limited
J1 J2 = 10118193-0001LF: USB - micro B USB 2.0 Receptacle Connector 5 Position Surface Mount, Right Angle; Through Hole; MF: Amphenol ICC; Availability: Unavailable; SnapEDA_Link: https://www.snapeda.com/parts/10118193-0001LF/Amphenol%20FCI/view-part/2758989/?ref=snap; MP: 10118193-0001LF; Price: None; Value: *; Package: None
Q1 Q2 = S8050: MF: MICROSS/On Semiconductor; MP: 2N2222; Value: *; Package: TO-18-3 NJS; Digi-Key_Purchase_URL: https://www.digikey.com.mx/product-detail/en/microsemi-corporation/JANS2N2222A/1086-15156-ND/4384334?utm_source=snapeda&utm_medium=aggregator&utm_campaign=symbol; SnapEDA_Link: https://www.snapeda.com/parts/2N2222/MICROSS/On%20Semiconductor/view-part/561967/?ref=snap; Digi-Key_Part_Number: 1086-15156-ND
R3-R17 R25 R26 = Resistor
SW5 SW6 = SPST Switch
U5 = ESP-WROOM-32: WiFi 802.11b/g/n/d/e/i Transceiver Module 2.4GHz Surface Mount; MF: Olimex LTD; SnapEDA_Link: https://www.snapeda.com/parts/ESP-WROOM-32/Olimex%20LTD/view-part/2311927/?ref=snap; Package: Module Olimex LTD; MP: ESP-WROOM-32; Availability: Unavailable; Price: None; Value: *
U8 = USBLC6-2P6: 17V Clamp 5A _8/20µs_ Ipp Tvs Diode Surface Mount SOT-666; MF: STMicroelectronics; Value: *; MP: USBLC6-2P6; SnapEDA_Link: https://www.snapeda.com/parts/USBLC6-2P6/STMicroelectronics/view-part/106846/?ref=snap; Availability: Unavailable; Price: None; Package: SOT-563 STMicroelectronics
C10 C11 C23-C26 = Cap: Published: 8-Jun-2000; LatestRevisionDate: 17-Jul-2002; LatestRevisionNote: Re-released for DXP Platform.; PackageReference: RAD-0.3; Publisher: Altium Limited; PackageDescription: Radial Cap, Thru-Hole; 2 Leads; 0.3 in Pin Spacing

## Nets that join several sheets
3V3: Power (6 pins), CAN (C1.2 U1.3), IMU (C2.2 C3.2 U2.8 U2.13), LED (U3.3 U3.6 U4.3 U4.6), MCU (29 pins)
5V: Controller R2 (8 pins), Power (6 pins), CAN (D1.1), LED (LED1.4 LED2.4 U3.4 U4.4), MCU (5 pins)
8V4: Controller R2 (CN25.2 CN26.2), Power (8 pins)
12V: Controller R2 (R23.1), Power (18 pins)
GND: Controller R2 (16 pins), Power (32 pins), CAN (7 pins), IMU (8 pins), LED (LED1.3 LED2.3 U3.2 U4.2), MCU (39 pins)
NetCN19_2: Controller R2 (CN19.2 CN20.2 CN21.2 CN22.2), MCU (U7.56)
NetCN19_3: Controller R2 (CN19.3), MCU (U7.2)
NetCN20_3: Controller R2 (CN20.3), MCU (U7.3)
NetCN21_3: Controller R2 (CN21.3), MCU (U7.4)
NetCN22_3: Controller R2 (CN22.3), MCU (U7.6)
NetCN23_1: Controller R2 (CN23.1), MCU (U7.21)
NetCN23_2: Controller R2 (CN23.2), MCU (U7.15)
NetCN23_3: Controller R2 (CN23.3), MCU (U7.16)
NetCN23_4: Controller R2 (CN23.4), MCU (U7.18)
NetCN23_5: Controller R2 (CN23.5), MCU (U7.8)
NetCN23_6: Controller R2 (CN23.6), MCU (U7.9)
NetCN23_7: Controller R2 (CN23.7), MCU (U7.10)
NetCN23_8: Controller R2 (CN23.8), MCU (U7.11)
NetCN24_1: Controller R2 (CN24.1 CN25.1 CN26.1), MCU (U7.24)
NetCN24_2: Controller R2 (CN24.2), MCU (U7.25)
NetCN27_1: Controller R2 (CN27.1), MCU (U7.27)
NetCN27_2: Controller R2 (CN27.2), MCU (U7.26)
NetCN27_3: Controller R2 (CN27.3), MCU (U7.30)
NetCN27_4: Controller R2 (CN27.4), MCU (U7.29)
NetCN27_5: Controller R2 (CN27.5), MCU (U7.28)
NetCN28_1: Controller R2 (CN28.1), MCU (U7.22)
NetCN28_3: Controller R2 (CN28.3), MCU (U7.23)
NetCN29_1: Controller R2 (CN29.1), MCU (U7.34)
NetCN30_2: Controller R2 (CN30.2), MCU (R26.1 U5.33)
NetCN30_3: Controller R2 (CN30.3), MCU (R25.1 U5.36)
NetCN31_2: Controller R2 (CN31.2 CN32.2), MCU (U7.43)
NetCN31_3: Controller R2 (CN31.3 CN32.3), MCU (U7.42)
NetR22_2: Controller R2 (R22.2), MCU (U7.54)
NetR23_2: Controller R2 (R23.2 R24.1), MCU (U7.14)
NetU1_1: CAN (U1.1), MCU (U7.62)
NetU1_4: CAN (U1.4), MCU (U7.61)
NetU2_23: IMU (U2.23), MCU (U7.58)
NetU2_24: IMU (U2.24), MCU (U7.59)
NetU3_1: LED (U3.1), MCU (U7.35)
NetU4_1: LED (U4.1), MCU (U7.36)
SWO: Controller R2 (CN19.1 CN20.1 CN21.1 CN22.1), MCU (CN8.1 CN9.1 U7.55)